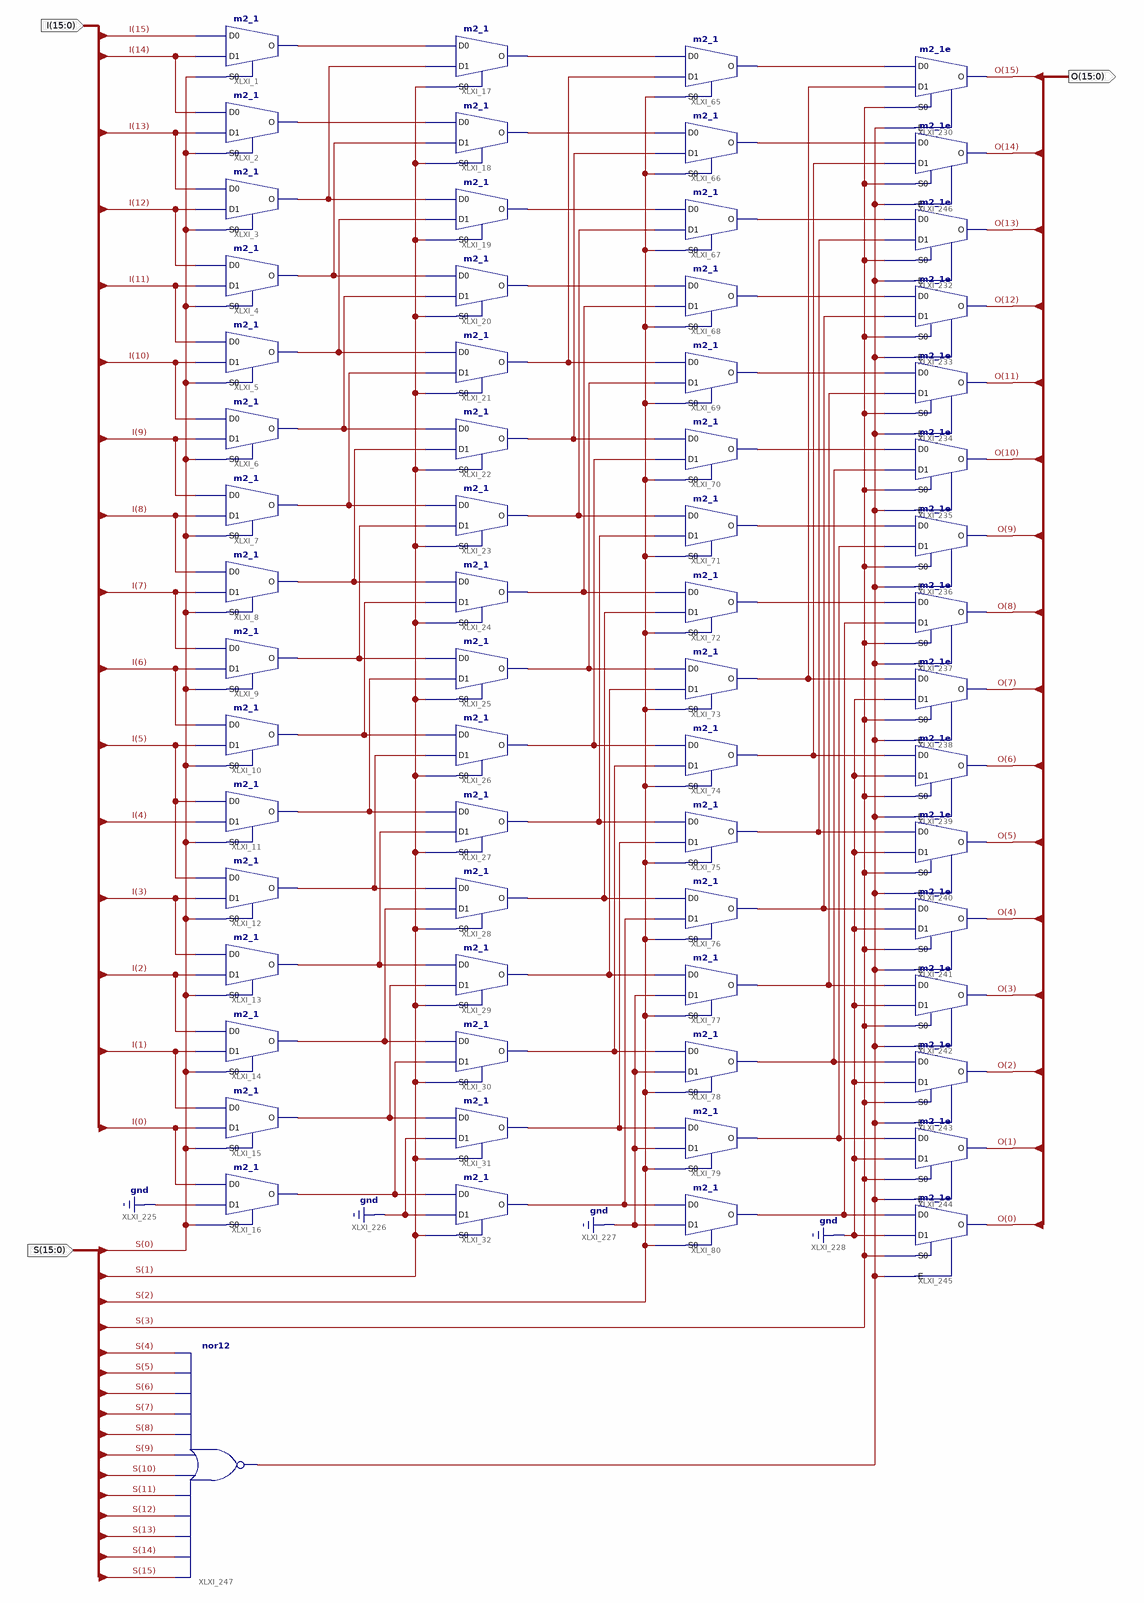
[diagram p0: schematic sheet 1]
// Xilinx ISE schematic lshift.sch (spartan6) as structural Verilog: 65 symbols, 3 ports
module lshift (
  input  [15:0] I,
  input  [15:0] S,
  output [15:0] O
);

  wire XLXN_56, XLXN_57, XLXN_73, XLXN_74, XLXN_75, XLXN_76, XLXN_77, XLXN_78, XLXN_80, XLXN_81, XLXN_82,
       XLXN_83, XLXN_84, XLXN_85, XLXN_86, XLXN_87, XLXN_88, XLXN_89, XLXN_90, XLXN_91, XLXN_116, XLXN_117,
       XLXN_118, XLXN_120, XLXN_121, XLXN_122, XLXN_123, XLXN_124, XLXN_125, XLXN_126, XLXN_127, XLXN_128,
       XLXN_129, XLXN_130, XLXN_131, XLXN_132, XLXN_133, XLXN_134, XLXN_135, XLXN_144, XLXN_145, XLXN_147,
       XLXN_148, XLXN_149, XLXN_150, XLXN_151, XLXN_153, XLXN_154, XLXN_246;

  m2_1 XLXI_1 (.D0(I[15]), .D1(I[14]), .S0(S[0]), .O(XLXN_56));
  m2_1 XLXI_2 (.D0(I[14]), .D1(I[13]), .S0(S[0]), .O(XLXN_57));
  m2_1 XLXI_3 (.D0(I[13]), .D1(I[12]), .S0(S[0]), .O(XLXN_87));
  m2_1 XLXI_4 (.D0(I[12]), .D1(I[11]), .S0(S[0]), .O(XLXN_86));
  m2_1 XLXI_5 (.D0(I[11]), .D1(I[10]), .S0(S[0]), .O(XLXN_85));
  m2_1 XLXI_6 (.D0(I[10]), .D1(I[9]), .S0(S[0]), .O(XLXN_84));
  m2_1 XLXI_7 (.D0(I[9]), .D1(I[8]), .S0(S[0]), .O(XLXN_83));
  m2_1 XLXI_8 (.D0(I[8]), .D1(I[7]), .S0(S[0]), .O(XLXN_82));
  m2_1 XLXI_9 (.D0(I[7]), .D1(I[6]), .S0(S[0]), .O(XLXN_81));
  m2_1 XLXI_10 (.D0(I[6]), .D1(I[5]), .S0(S[0]), .O(XLXN_80));
  m2_1 XLXI_11 (.D0(I[5]), .D1(I[4]), .S0(S[0]), .O(XLXN_78));
  m2_1 XLXI_12 (.D0(I[5]), .D1(I[3]), .S0(S[0]), .O(XLXN_77));
  m2_1 XLXI_13 (.D0(I[3]), .D1(I[2]), .S0(S[0]), .O(XLXN_76));
  m2_1 XLXI_14 (.D0(I[2]), .D1(I[1]), .S0(S[0]), .O(XLXN_75));
  m2_1 XLXI_15 (.D0(I[1]), .D1(I[0]), .S0(S[0]), .O(XLXN_74));
  m2_1 XLXI_16 (.D0(I[0]), .D1(1'b0), .S0(S[0]), .O(XLXN_73));
  m2_1 XLXI_17 (.D0(XLXN_56), .D1(XLXN_87), .S0(S[1]), .O(XLXN_88));
  m2_1 XLXI_18 (.D0(XLXN_57), .D1(XLXN_86), .S0(S[1]), .O(XLXN_89));
  m2_1 XLXI_19 (.D0(XLXN_87), .D1(XLXN_85), .S0(S[1]), .O(XLXN_90));
  m2_1 XLXI_20 (.D0(XLXN_86), .D1(XLXN_84), .S0(S[1]), .O(XLXN_91));
  m2_1 XLXI_21 (.D0(XLXN_85), .D1(XLXN_83), .S0(S[1]), .O(XLXN_135));
  m2_1 XLXI_22 (.D0(XLXN_84), .D1(XLXN_82), .S0(S[1]), .O(XLXN_134));
  m2_1 XLXI_23 (.D0(XLXN_83), .D1(XLXN_81), .S0(S[1]), .O(XLXN_133));
  m2_1 XLXI_24 (.D0(XLXN_82), .D1(XLXN_80), .S0(S[1]), .O(XLXN_132));
  m2_1 XLXI_25 (.D0(XLXN_81), .D1(XLXN_78), .S0(S[1]), .O(XLXN_131));
  m2_1 XLXI_26 (.D0(XLXN_80), .D1(XLXN_77), .S0(S[1]), .O(XLXN_130));
  m2_1 XLXI_27 (.D0(XLXN_78), .D1(XLXN_76), .S0(S[1]), .O(XLXN_129));
  m2_1 XLXI_28 (.D0(XLXN_77), .D1(XLXN_75), .S0(S[1]), .O(XLXN_128));
  m2_1 XLXI_29 (.D0(XLXN_76), .D1(XLXN_74), .S0(S[1]), .O(XLXN_127));
  m2_1 XLXI_30 (.D0(XLXN_75), .D1(XLXN_73), .S0(S[1]), .O(XLXN_126));
  m2_1 XLXI_31 (.D0(XLXN_74), .D1(1'b0), .S0(S[1]), .O(XLXN_125));
  m2_1 XLXI_32 (.D0(XLXN_73), .D1(1'b0), .S0(S[1]), .O(XLXN_124));
  m2_1 XLXI_65 (.D0(XLXN_88), .D1(XLXN_135), .S0(S[2]), .O(XLXN_123));
  m2_1 XLXI_66 (.D0(XLXN_89), .D1(XLXN_134), .S0(S[2]), .O(XLXN_122));
  m2_1 XLXI_67 (.D0(XLXN_90), .D1(XLXN_133), .S0(S[2]), .O(XLXN_121));
  m2_1 XLXI_68 (.D0(XLXN_91), .D1(XLXN_132), .S0(S[2]), .O(XLXN_120));
  m2_1 XLXI_69 (.D0(XLXN_135), .D1(XLXN_131), .S0(S[2]), .O(XLXN_118));
  m2_1 XLXI_70 (.D0(XLXN_134), .D1(XLXN_130), .S0(S[2]), .O(XLXN_117));
  m2_1 XLXI_71 (.D0(XLXN_133), .D1(XLXN_129), .S0(S[2]), .O(XLXN_116));
  m2_1 XLXI_72 (.D0(XLXN_132), .D1(XLXN_128), .S0(S[2]), .O(XLXN_144));
  m2_1 XLXI_73 (.D0(XLXN_131), .D1(XLXN_127), .S0(S[2]), .O(XLXN_154));
  m2_1 XLXI_74 (.D0(XLXN_130), .D1(XLXN_126), .S0(S[2]), .O(XLXN_153));
  m2_1 XLXI_75 (.D0(XLXN_129), .D1(XLXN_125), .S0(S[2]), .O(XLXN_151));
  m2_1 XLXI_76 (.D0(XLXN_128), .D1(XLXN_124), .S0(S[2]), .O(XLXN_150));
  m2_1 XLXI_77 (.D0(XLXN_127), .D1(1'b0), .S0(S[2]), .O(XLXN_149));
  m2_1 XLXI_78 (.D0(XLXN_126), .D1(1'b0), .S0(S[2]), .O(XLXN_148));
  m2_1 XLXI_79 (.D0(XLXN_125), .D1(1'b0), .S0(S[2]), .O(XLXN_147));
  m2_1 XLXI_80 (.D0(XLXN_124), .D1(1'b0), .S0(S[2]), .O(XLXN_145));
  m2_1e XLXI_230 (.D0(XLXN_123), .D1(XLXN_154), .E(XLXN_246), .S0(S[3]), .O(O[15]));
  m2_1e XLXI_232 (.D0(XLXN_121), .D1(XLXN_151), .E(XLXN_246), .S0(S[3]), .O(O[13]));
  m2_1e XLXI_233 (.D0(XLXN_120), .D1(XLXN_150), .E(XLXN_246), .S0(S[3]), .O(O[12]));
  m2_1e XLXI_234 (.D0(XLXN_118), .D1(XLXN_149), .E(XLXN_246), .S0(S[3]), .O(O[11]));
  m2_1e XLXI_235 (.D0(XLXN_117), .D1(XLXN_148), .E(XLXN_246), .S0(S[3]), .O(O[10]));
  m2_1e XLXI_236 (.D0(XLXN_116), .D1(XLXN_147), .E(XLXN_246), .S0(S[3]), .O(O[9]));
  m2_1e XLXI_237 (.D0(XLXN_144), .D1(XLXN_145), .E(XLXN_246), .S0(S[3]), .O(O[8]));
  m2_1e XLXI_238 (.D0(XLXN_154), .D1(1'b0), .E(XLXN_246), .S0(S[3]), .O(O[7]));
  m2_1e XLXI_239 (.D0(XLXN_153), .D1(1'b0), .E(XLXN_246), .S0(S[3]), .O(O[6]));
  m2_1e XLXI_240 (.D0(XLXN_151), .D1(1'b0), .E(XLXN_246), .S0(S[3]), .O(O[5]));
  m2_1e XLXI_241 (.D0(XLXN_150), .D1(1'b0), .E(XLXN_246), .S0(S[3]), .O(O[4]));
  m2_1e XLXI_242 (.D0(XLXN_149), .D1(1'b0), .E(XLXN_246), .S0(S[3]), .O(O[3]));
  m2_1e XLXI_243 (.D0(XLXN_148), .D1(1'b0), .E(XLXN_246), .S0(S[3]), .O(O[2]));
  m2_1e XLXI_244 (.D0(XLXN_147), .D1(1'b0), .E(XLXN_246), .S0(S[3]), .O(O[1]));
  m2_1e XLXI_245 (.D0(XLXN_145), .D1(1'b0), .E(XLXN_246), .S0(S[3]), .O(O[0]));
  m2_1e XLXI_246 (.D0(XLXN_122), .D1(XLXN_153), .E(XLXN_246), .S0(S[3]), .O(O[14]));
  nor XLXI_247 (XLXN_246, S[15], S[14], S[13], S[12], S[11], S[10], S[9], S[8], S[7], S[6], S[5], S[4]);
endmodule
